# Altium schematic sheet STC12C5A60S2.SchDoc
size A3
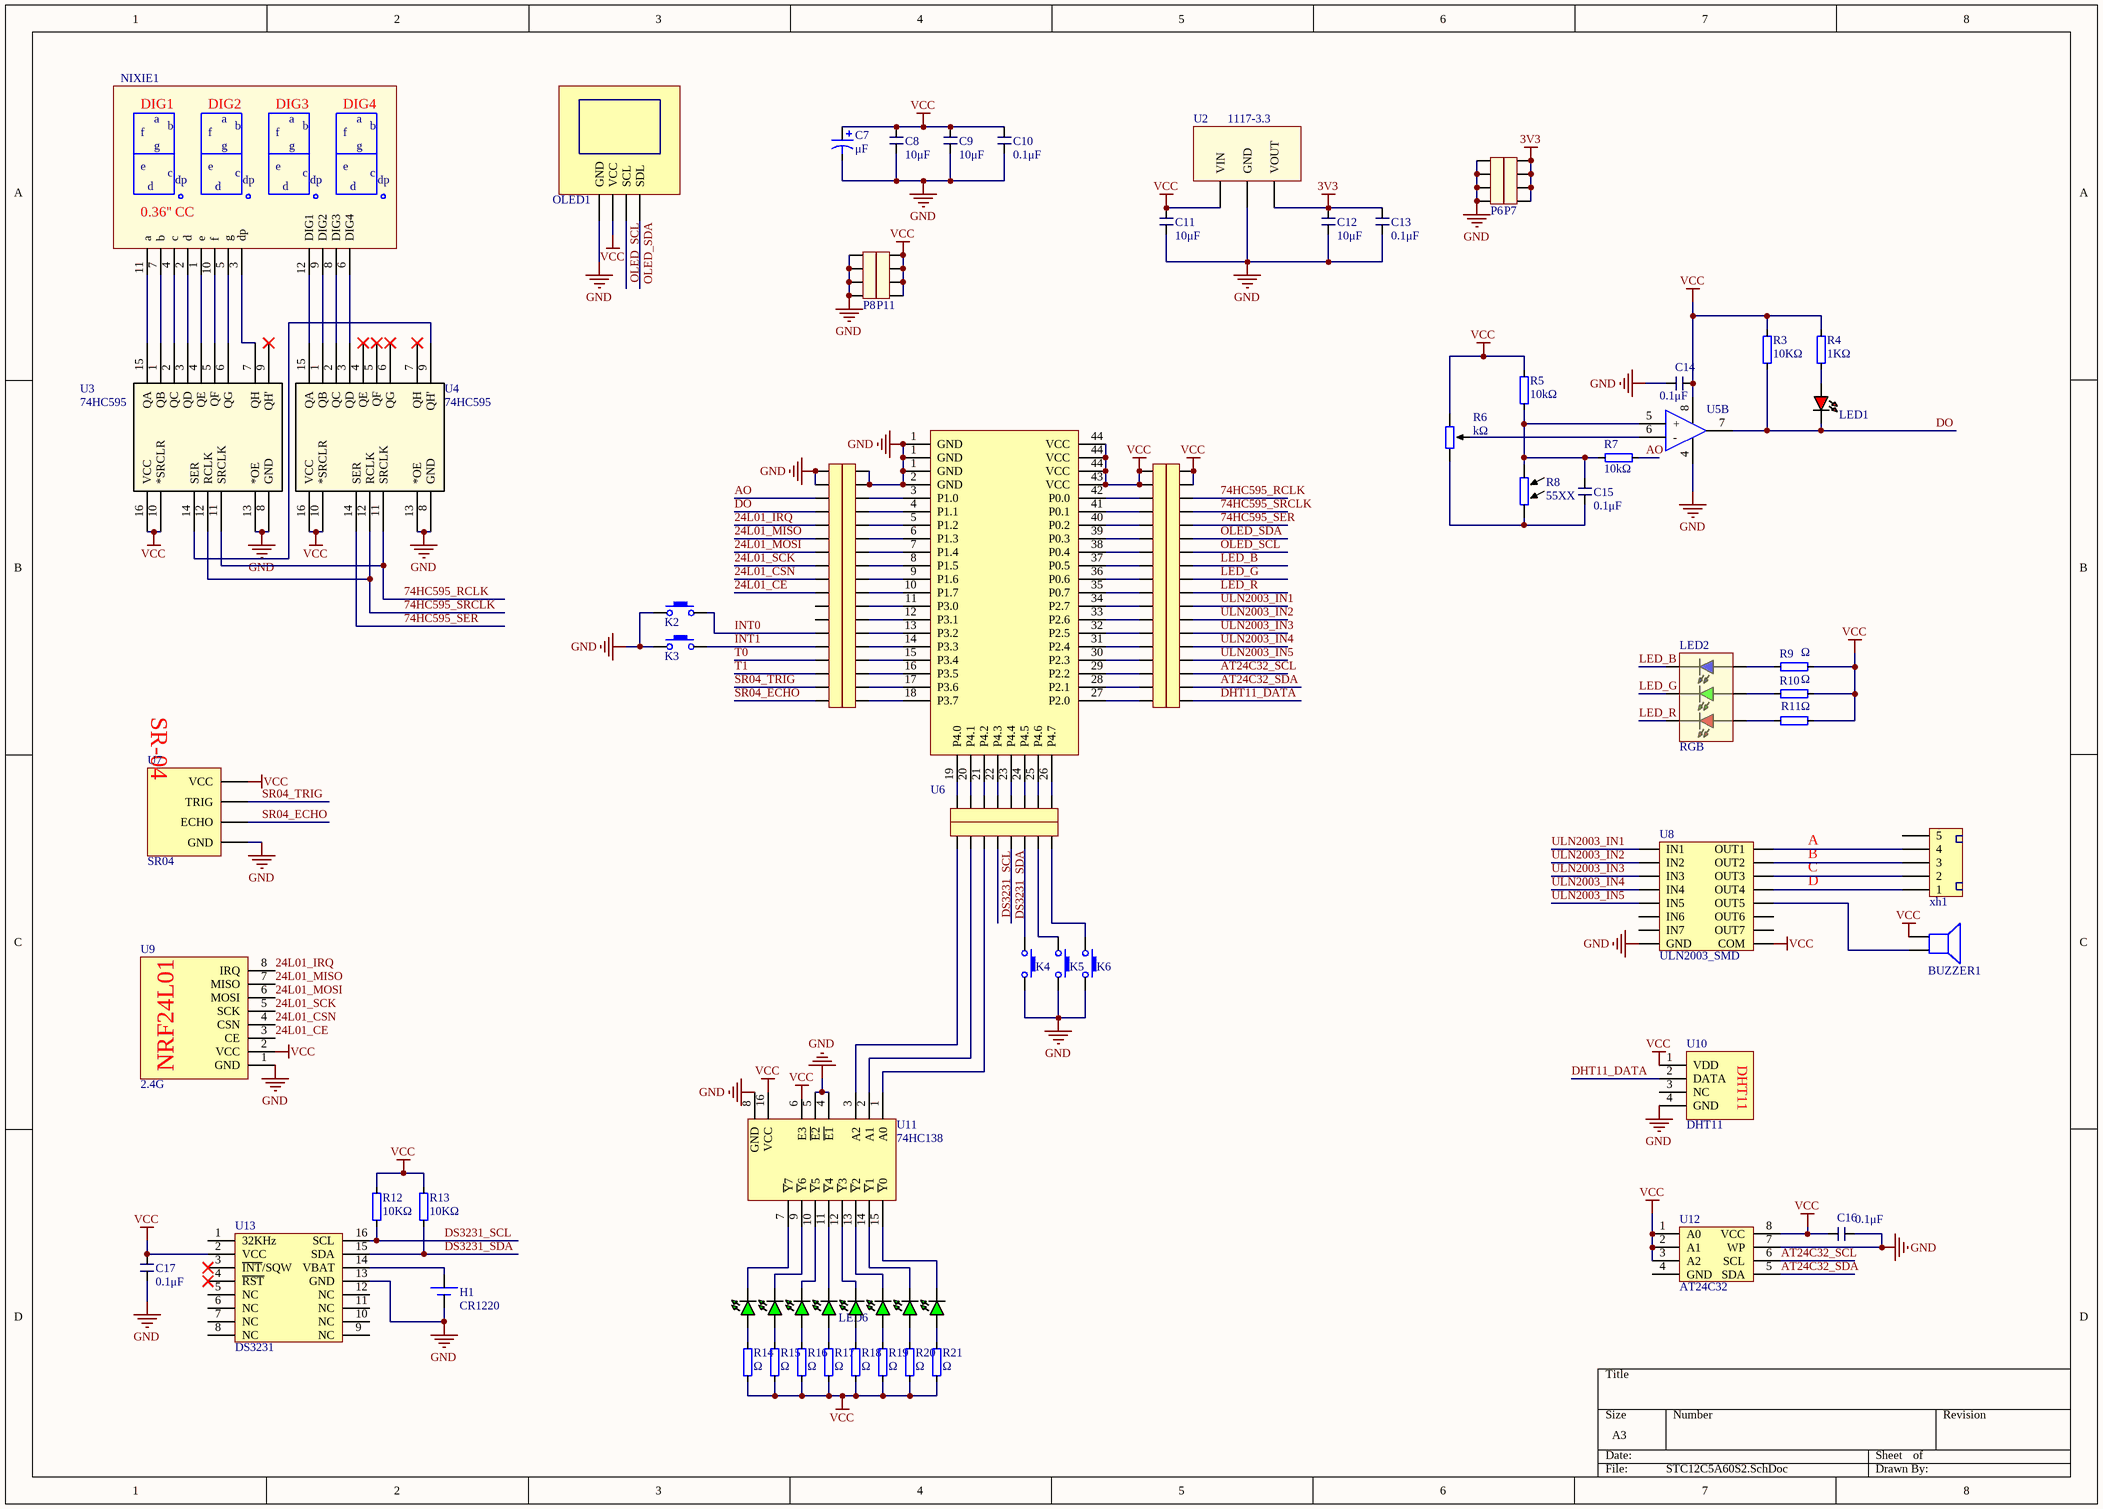
[diagram p0: STC12C5A60S2.SchDoc]

## Parts
BUZZER1  BUZZER 9.6X5.5_4MM  [BUZZER9.6x4_4mm]  (value not drawn)
C7  μF  [TAC_C]
C8  10μF  [C_0805]
C9  10μF  [C_0805]
C10  0.1μF  [C_0805]
C11  10μF  [C_0805]
C12  10μF  [C_0805]
C13  0.1μF  [C_0805]
C14  0.1μF  [C_0805]
C15  0.1μF  [C_0805]
C16  0.1μF  [C_0805]
C17  0.1μF  [C_0805]
H1  CR1220  [holder_CR1220_SMD]
K2  TACT SWITCH_4_DIP  [TACT SWITCH_4_DIP]  (value not drawn)
K3  TACT SWITCH_4_DIP  [TACT SWITCH_4_DIP]  (value not drawn)
K4  TACT SWITCH_4_DIP  [TACT SWITCH_4_DIP]  (value not drawn)
K5  TACT SWITCH_4_DIP  [TACT SWITCH_4_DIP]  (value not drawn)
K6  TACT SWITCH_4_DIP  [TACT SWITCH_4_DIP]  (value not drawn)
LED1  LED_0603-R  [LED_0603-R]  (value not drawn)
LED2  RGB  [LED 5050_RGB]
LED3  LED_0603-G  [LED_0603-G]  (value not drawn)
LED4  LED_0603-G  [LED_0603-G]  (value not drawn)
LED5  LED_0603-G  [LED_0603-G]  (value not drawn)
LED6  LED_0603-G  [LED_0603-G]  (value not drawn)
LED7  LED_0603-G  [LED_0603-G]  (value not drawn)
LED8  LED_0603-G  [LED_0603-G]  (value not drawn)
LED9  LED_0603-G  [LED_0603-G]  (value not drawn)
LED10  LED_0603-G  [LED_0603-G]  (value not drawn)
NIXIE1  Nixie Tube_CC(0.36in)_4  [Nixie Tube_4(0.36in)]  (value not drawn)
OLED1  0.96''  [OLED 0.96'']  (value not drawn)
P6  PIN4  [PIN_4]  (value not drawn)
P7  PIN4  [PIN_4]  (value not drawn)
P8  PIN4  [PIN_4]  (value not drawn)
P11  PIN4  [PIN_4]  (value not drawn)
P12  PIN8  [PIN_8]  (value not drawn)
P13  PIN8  [PIN_8]  (value not drawn)
PIN1  PIN18  [PIN_18]  (value not drawn)
PIN2  PIN18  [PIN_18]  (value not drawn)
PIN3  PIN18  [PIN_18]  (value not drawn)
PIN4  PIN18  [PIN_18]  (value not drawn)
R3  10KΩ  [R_0805]
R4  1KΩ  [R_0805]
R5  10kΩ  [R_0805]
R6  kΩ  [RP_3362P]
R7  10kΩ  [R_0805]
R8  55XX  [GM55-55XX]
R9  Ω  [R_0805]
R10  Ω  [R_0805]
R11  Ω  [R_0805]
R12  10KΩ  [R_0805]
R13  10KΩ  [R_0805]
R14  Ω  [R_0805]
R15  Ω  [R_0805]
R16  Ω  [R_0805]
R17  Ω  [R_0805]
R18  Ω  [R_0805]
R19  Ω  [R_0805]
R20  Ω  [R_0805]
R21  Ω  [R_0805]
U2  1117-3.3  [SOT_223]
U3  74HC595  [SOP_16]
U4  74HC595  [SOP_16]
U5  LM393_DIP  [SOP_8]  (value not drawn)  (part B of 2)
U6  socket  [STC12_moudle]  (value not drawn)
U7  SR04  [SR04]
U8  ULN2003_SMD  [SOP_16]
U9  2.4G  [NRF24L01]
U10  DHT11  [DHT11]
U11  74HC138  [SOP_16]
U12  AT24C32  [SOP_8]
U13  DS3231  [SOP_16]
xh1  XH2.54_5  [XH2.54_5]  (value not drawn)

## Nets
3V3: C12.1 C13.1 P7.1 P7.2 P7.3 P7.4 U2.2(VOUT)
GND: C7.2 C8.2 C9.2 C10.2 C11.2 C12.2 C13.2 C14.1 C16.2 C17.2 H1.2(-) K2.1 K3.1 K4.2 K5.2 K6.2 OLED1.1(GND) P6.1 P6.2 P6.3 P6.4 P8.1 P8.2 P8.3 P8.4 PIN1.17 PIN1.18 PIN2.17 PIN2.18 U2.1(GND) U3.8(GND) U3.13(*OE) U4.8(GND) U4.13(*OE) U5.4(GND) U6.1(GND) U6.2(GND) U7.4(GND) U8.8(GND) U9.1(GND) U10.4(GND) U11.4(~{E1}) U11.5(~{E2}) U11.8(GND) U12.7(WP) U13.13(GND)
VCC: BUZZER1.1(+) C7.1 C8.1 C9.1 C10.1 C11.1 C14.2 C16.1 C17.1 OLED1.2(VCC) P11.1 P11.2 P11.3 P11.4 PIN3.17 PIN3.18 PIN4.17 PIN4.18 R3.2 R4.2 R5.1 R6.1 R9.2 R10.2 R11.2 R12.2 R13.2 R14.1 R15.1 R16.1 R17.1 R18.1 R19.1 R20.1 R21.1 U2.3(VIN) U3.10(*SRCLR) U3.16(VCC) U4.10(*SRCLR) U4.16(VCC) U5.8(VCC) U6.43(VCC) U6.44(VCC) U7.1(VCC) U8.9(COM) U9.2(VCC) U10.1(VDD) U11.16(VCC) U12.1(A0) U12.2(A1) U12.3(A2) U12.8(VCC) U13.2(VCC)
24L01_CE: PIN1.9 U9.3(CE)
24L01_CSN: PIN1.10 U9.4(CSN)
24L01_IRQ: PIN1.14 U9.8(IRQ)
24L01_MISO: PIN1.13 U9.7(MISO)
24L01_MOSI: PIN1.12 U9.6(MOSI)
24L01_SCK: PIN1.11 U9.5(SCK)
74HC595_RCLK: PIN4.16 U3.11(SRCLK) U4.11(SRCLK)
74HC595_SER: PIN4.14 U4.14(SER)
74HC595_SRCLK: PIN4.15 U3.12(RCLK) U4.12(RCLK)
AO: PIN1.16 R7.2
AT24C32_SCL: PIN4.3 U12.6(SCL)
AT24C32_SDA: PIN4.2 U12.5(SDA)
DHT11_DATA: PIN4.1 U10.2(DATA)
DO: LED1.2 PIN1.15 R3.1 U5.7
DS3231_SCL: P13.4 R12.1 U13.16(SCL)
DS3231_SDA: P13.5 R13.1 U13.15(SDA)
INT0: K2.2 PIN1.6
INT1: K3.2 PIN1.5
LED_B: LED2.1 PIN4.11
LED_G: LED2.5 PIN4.10
LED_R: LED2.3 PIN4.9
OLED_SCL: OLED1.3(SCL) PIN4.12
OLED_SDA: OLED1.4(SDL) PIN4.13
SR04_ECHO: PIN1.1 U7.3(ECHO)
SR04_TRIG: PIN1.2 U7.2(TRIG)
T0: PIN1.4
T1: PIN1.3
ULN2003_IN1: PIN4.8 U8.1(IN1)
ULN2003_IN2: PIN4.7 U8.2(IN2)
ULN2003_IN3: PIN4.6 U8.3(IN3)
ULN2003_IN4: PIN4.5 U8.4(IN4)
ULN2003_IN5: PIN4.4 U8.5(IN5)
NetBUZZER1_2: BUZZER1.2 U8.12(OUT5)
NetC15_1: C15.1 R5.2 R7.1 R8.1 U5.5(+)
NetC15_2: C15.2 R6.3 R8.2
NetH1_1: H1.1(+) U13.14(VBAT)
NetK4_1: K4.1 P13.6
NetK5_1: K5.1 P13.7
NetK6_1: K6.1 P13.8
NetLED1_1: LED1.1 R4.1
NetLED2_2: LED2.2 R9.1
NetLED2_4: LED2.4 R11.1
NetLED2_6: LED2.6 R10.1
NetLED3_1: LED3.1 R14.2
NetLED3_2: LED3.2 U11.7(~{Y}7)
NetLED4_1: LED4.1 R15.2
NetLED4_2: LED4.2 U11.9(~{Y}6)
NetLED5_1: LED5.1 R16.2
NetLED5_2: LED5.2 U11.10(~{Y}5)
NetLED6_1: LED6.1 R17.2
NetLED6_2: LED6.2 U11.11(~{Y}4)
NetLED7_1: LED7.1 R18.2
NetLED7_2: LED7.2 U11.12(~{Y}3)
NetLED8_1: LED8.1 R19.2
NetLED8_2: LED8.2 U11.13(~{Y}2)
NetLED9_1: LED9.1 R20.2
NetLED9_2: LED9.2 U11.14(~{Y}1)
NetLED10_1: LED10.1 R21.2
NetLED10_2: LED10.2 U11.15(~{Y}0)
NetNIXIE1_1: NIXIE1.1(e) U3.4(QE)
NetNIXIE1_2: NIXIE1.2(d) U3.3(QD)
NetNIXIE1_3: NIXIE1.3(dp) U3.7(QH)
NetNIXIE1_4: NIXIE1.4(c) U3.2(QC)
NetNIXIE1_5: NIXIE1.5(g) U3.6(QG)
NetNIXIE1_6: NIXIE1.6(DIG4) U4.3(QD)
NetNIXIE1_7: NIXIE1.7(b) U3.1(QB)
NetNIXIE1_8: NIXIE1.8(DIG3) U4.2(QC)
NetNIXIE1_9: NIXIE1.9(DIG2) U4.1(QB)
NetNIXIE1_10: NIXIE1.10(f) U3.5(QF)
NetNIXIE1_11: NIXIE1.11(a) U3.15(QA)
NetNIXIE1_12: NIXIE1.12(DIG1) U4.15(QA)
NetP12_1: P12.1 U6.19(P4.0)
NetP12_2: P12.2 U6.20(P4.1)
NetP12_3: P12.3 U6.21(P4.2)
NetP12_4: P12.4 U6.22(P4.3)
NetP12_5: P12.5 U6.23(P4.4)
NetP12_6: P12.6 U6.24(P4.5)
NetP12_7: P12.7 U6.25(P4.6)
NetP12_8: P12.8 U6.26(P4.7)
NetP13_1: P13.1 U11.3(A2)
NetP13_2: P13.2 U11.2(A1)
NetP13_3: P13.3 U11.1(A0)
NetPIN2_1: PIN2.1 U6.18(P3.7)
NetPIN2_2: PIN2.2 U6.17(P3.6)
NetPIN2_3: PIN2.3 U6.16(P3.5)
NetPIN2_4: PIN2.4 U6.15(P3.4)
NetPIN2_5: PIN2.5 U6.14(P3.3)
NetPIN2_6: PIN2.6 U6.13(P3.2)
NetPIN2_7: PIN2.7 U6.12(P3.1)
NetPIN2_8: PIN2.8 U6.11(P3.0)
NetPIN2_9: PIN2.9 U6.10(P1.7)
NetPIN2_10: PIN2.10 U6.9(P1.6)
NetPIN2_11: PIN2.11 U6.8(P1.5)
NetPIN2_12: PIN2.12 U6.7(P1.4)
NetPIN2_13: PIN2.13 U6.6(P1.3)
NetPIN2_14: PIN2.14 U6.5(P1.2)
NetPIN2_15: PIN2.15 U6.4(P1.1)
NetPIN2_16: PIN2.16 U6.3(P1.0)
NetPIN3_1: PIN3.1 U6.27(P2.0)
NetPIN3_2: PIN3.2 U6.28(P2.1)
NetPIN3_3: PIN3.3 U6.29(P2.2)
NetPIN3_4: PIN3.4 U6.30(P2.3)
NetPIN3_5: PIN3.5 U6.31(P2.4)
NetPIN3_6: PIN3.6 U6.32(P2.5)
NetPIN3_7: PIN3.7 U6.33(P2.6)
NetPIN3_8: PIN3.8 U6.34(P2.7)
NetPIN3_9: PIN3.9 U6.35(P0.7)
NetPIN3_10: PIN3.10 U6.36(P0.6)
NetPIN3_11: PIN3.11 U6.37(P0.5)
NetPIN3_12: PIN3.12 U6.38(P0.4)
NetPIN3_13: PIN3.13 U6.39(P0.3)
NetPIN3_14: PIN3.14 U6.40(P0.2)
NetPIN3_15: PIN3.15 U6.41(P0.1)
NetPIN3_16: PIN3.16 U6.42(P0.0)
NetR6_2: R6.2 U5.6(-)
NetU3_14: U3.14(SER) U4.9(QH')
NetU8_13: U8.13(OUT4) xh1.1
NetU8_14: U8.14(OUT3) xh1.2
NetU8_15: U8.15(OUT2) xh1.3
NetU8_16: U8.16(OUT1) xh1.4

Not connected (* = marked no-connect by the designer): PIN1 7 8; U3 9(QH')*; U4 4(QE)* 5(QF)* 6(QG)* 7(QH)*; U8 6(IN6) 7(IN7) 10(OUT7) 11(OUT6); U10 3(NC); U11 6(E3); U12 4(GND); U13 1(32KHz) 3(~{INT}/SQW)* 4(~{RST})* 5(NC) 6(NC) 7(NC) 8(NC) 9(NC) 10(NC) 11(NC) 12(NC); xh1 5

## Notes on the sheet
- B
- A
- C
- D
- Labels drawn without touching a wire or pin: VCC
- (in symbol Nixie Tube_CC(0.36in)_4) 0.36'' CC
- (in symbol SR04) SR-04

## Library data of the parts
C7 = C_TAC-C
C8-C17 = C_0805
H1 = holder_CR1220_SMD
LED2 = LED_5050_RGB
OLED1 = OLED 0.96''_module
R3-R5 R7 R9-R21 = R_0805
R6 = RP_3362P
R8 = GM55-55XX
U2 = AMS1117-3.3
U6 = STC12C_module
U9 = NRF24L01
U13 = DS3231_SOP16